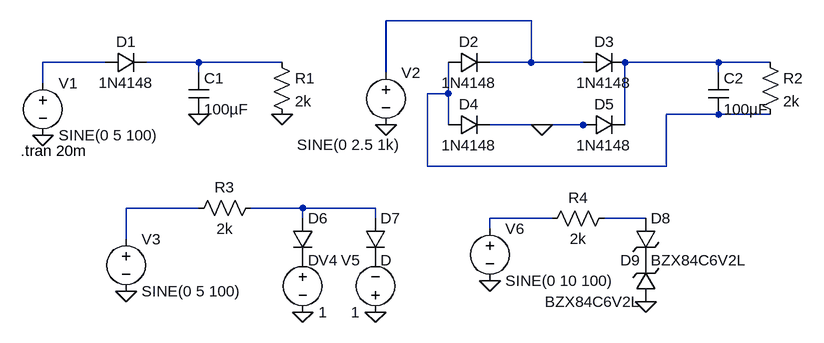
[diagram p0: schematic Prelab.asc]
Prelab.asc, the LTspice schematic file:
Version 4
SHEET 1 1296 680
WIRE 848 32 624 32
WIRE 192 96 96 96
WIRE 336 96 256 96
WIRE 464 96 336 96
WIRE 848 96 848 32
WIRE 848 96 784 96
WIRE 928 96 848 96
WIRE 1136 96 992 96
WIRE 1216 96 1136 96
WIRE 336 112 336 96
WIRE 624 112 624 32
WIRE 1136 112 1136 96
WIRE 96 128 96 96
WIRE 720 144 720 96
WIRE 720 144 688 144
WIRE 1136 176 1056 176
WIRE 1216 176 1136 176
WIRE 720 192 720 144
WIRE 864 192 784 192
WIRE 928 192 864 192
WIRE 944 192 928 192
WIRE 992 192 992 96
WIRE 688 256 688 144
WIRE 1056 256 1056 176
WIRE 1056 256 688 256
WIRE 336 320 224 320
WIRE 496 320 416 320
WIRE 608 320 496 320
WIRE 496 336 496 320
WIRE 608 336 608 320
WIRE 880 336 784 336
WIRE 1024 336 960 336
WIRE 784 352 784 336
WIRE 224 368 224 320
FLAG 336 176 0
FLAG 464 176 0
FLAG 96 208 0
FLAG 864 192 0
FLAG 624 192 0
FLAG 224 448 0
FLAG 496 480 0
FLAG 608 480 0
FLAG 1024 464 0
FLAG 784 432 0
SYMBOL voltage 96 112 R0
WINDOW 123 0 0 Left 0
WINDOW 39 0 0 Left 0
SYMATTR InstName V1
SYMATTR Value SINE(0 5 100)
SYMBOL diode 192 112 R270
WINDOW 0 32 32 VTop 2
WINDOW 3 0 32 VBottom 2
SYMATTR InstName D1
SYMATTR Value 1N4148
SYMBOL cap 320 112 R0
SYMATTR InstName C1
SYMATTR Value 100µF
SYMBOL res 448 80 R0
SYMATTR InstName R1
SYMATTR Value 2k
SYMBOL diode 720 112 R270
WINDOW 0 32 32 VTop 2
WINDOW 3 0 32 VBottom 2
SYMATTR InstName D2
SYMATTR Value 1N4148
SYMBOL diode 928 112 R270
WINDOW 0 32 32 VTop 2
WINDOW 3 0 32 VBottom 2
SYMATTR InstName D3
SYMATTR Value 1N4148
SYMBOL diode 720 208 R270
WINDOW 0 32 32 VTop 2
WINDOW 3 0 32 VBottom 2
SYMATTR InstName D4
SYMATTR Value 1N4148
SYMBOL diode 928 208 R270
WINDOW 0 32 32 VTop 2
WINDOW 3 0 32 VBottom 2
SYMATTR InstName D5
SYMATTR Value 1N4148
SYMBOL voltage 624 96 R0
WINDOW 3 -137 127 Left 2
WINDOW 123 0 0 Left 0
WINDOW 39 0 0 Left 0
SYMATTR InstName V2
SYMATTR Value SINE(0 2.5 1k)
SYMBOL cap 1120 112 R0
SYMATTR InstName C2
SYMATTR Value 100µF
SYMBOL res 1200 80 R0
SYMATTR InstName R2
SYMATTR Value 2k
SYMBOL voltage 224 352 R0
WINDOW 123 0 0 Left 0
WINDOW 39 0 0 Left 0
SYMATTR InstName V3
SYMATTR Value SINE(0 5 100)
SYMBOL res 432 304 R90
WINDOW 0 0 56 VBottom 2
WINDOW 3 32 56 VTop 2
SYMATTR InstName R3
SYMATTR Value 2k
SYMBOL diode 480 336 R0
SYMATTR InstName D6
SYMBOL diode 592 336 R0
SYMATTR InstName D7
SYMBOL voltage 496 384 R0
WINDOW 123 0 0 Left 0
WINDOW 39 0 0 Left 0
SYMATTR InstName V4
SYMATTR Value 1
SYMBOL voltage 608 496 R180
WINDOW 0 24 96 Left 2
WINDOW 3 24 16 Left 2
WINDOW 123 0 0 Left 0
WINDOW 39 0 0 Left 0
SYMATTR InstName V5
SYMATTR Value 1
SYMBOL voltage 784 336 R0
WINDOW 123 0 0 Left 0
WINDOW 39 0 0 Left 0
SYMATTR InstName V6
SYMATTR Value SINE(0 10 100)
SYMBOL res 976 320 R90
WINDOW 0 0 56 VBottom 2
WINDOW 3 32 56 VTop 2
SYMATTR InstName R4
SYMATTR Value 2k
SYMBOL zener 1008 336 R0
SYMATTR InstName D8
SYMATTR Value BZX84C6V2L
SYMATTR Description Diode
SYMATTR Type diode
SYMBOL zener 1040 464 R180
WINDOW 0 24 64 Left 2
WINDOW 3 24 0 Left 2
SYMATTR InstName D9
SYMATTR Value BZX84C6V2L
SYMATTR Description Diode
SYMATTR Type diode
TEXT 62 232 Left 2 !.tran 20m

The netlist it stands for:
* Prelab.asc
V1 N002 0 SINE(0 5 100)
D1 N002 N003 1N4148
C1 N003 0 100µF
R1 N003 0 2k
D2 N005 N001 1N4148
D3 N001 N004 1N4148
D4 N005 0 1N4148
D5 0 N004 1N4148
V2 N001 0 SINE(0 2.5 1k)
C2 N004 N005 100µF
R2 N004 N005 2k
V3 N006 0 SINE(0 5 100)
R3 N007 N006 2k
D6 N007 P001 D
D7 N007 P002 D
V4 P001 0 1
V5 0 P002 1
V6 N008 0 SINE(0 10 100)
R4 N009 N008 2k
D8 N009 P003 BZX84C6V2L
D9 0 P003 BZX84C6V2L
.model D D
.lib standard.dio
.tran 20m
.backanno
.end